# EAGLE design cp2101-esp32 (EAGLE 9.6.2)
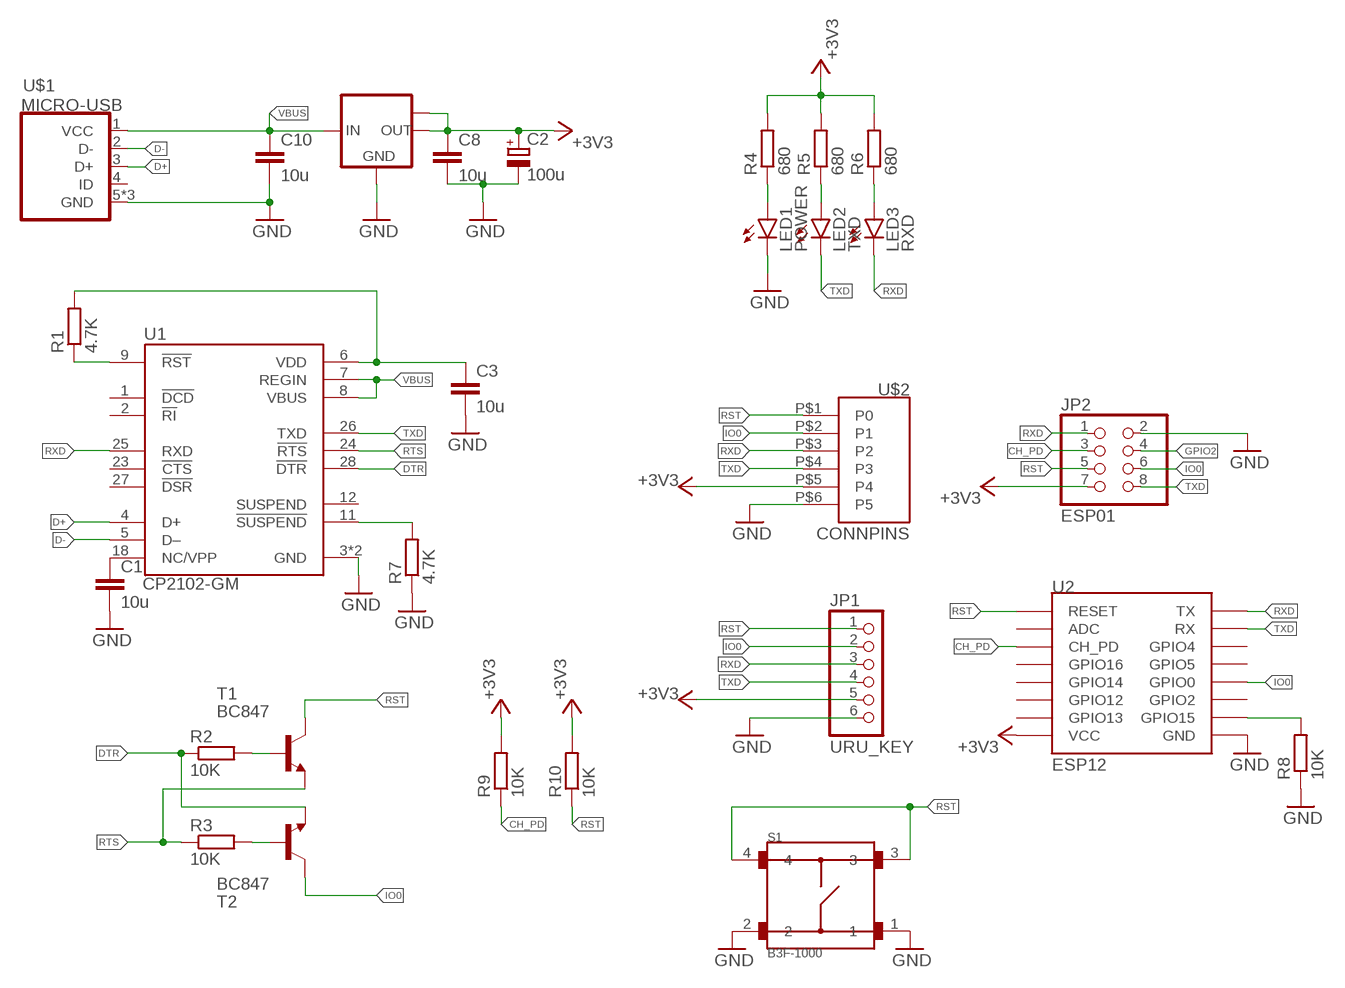
[diagram p0: schematic, sheet 1]

## Parts
C1  10u  C-EUC0805  [C0805]
C2  100u  CPOL-EUA/3216-18R  [A/3216-18R]
C3  10u  C-EUC0805  [C0805]
C8  10u  C-EUC0805  [C0805]
C10  10u  C-EUC0805  [C0805]
IC1  LM1117MPX-3.3  [SOT223]
JP1  URU_KEY  PINHD-1X6/90  [1X06/90]
JP2  ESP01  PINHD-2X4  [2X04]
LED1  POWER  LEDCHIP-LED0805  [CHIP-LED0805]
LED2  TXD  LEDCHIP-LED0805  [CHIP-LED0805]
LED3  RXD  LEDCHIP-LED0805  [CHIP-LED0805]
R1  4.7K  R-EU_R0805  [R0805]
R2  10K  R-EU_R0805  [R0805]
R3  10K  R-EU_R0805  [R0805]
R4  680  R-EU_R0805  [R0805]
R5  680  R-EU_R0805  [R0805]
R6  680  R-EU_R0805  [R0805]
R7  4.7K  R-EU_R0805  [R0805]
R8  10K  R-EU_R0805  [R0805]
R9  10K  R-EU_R0805  [R0805]
R10  10K  R-EU_R0805  [R0805]
S1  B3F-1000  [SW_B3F-1000]
T1  BC847  [SOT23]
T2  BC847  [SOT23]
U1  CP2102-GM  [QFN50P500X500X100-29N]
U2  ESP12  [ESP12]
U$1  MICRO-USB  [MICRO-USB]
U$2  CONNPINS  [PINS]

## Nets
+3V3 [VCC]: C2.+ C8.1 IC1.2(OUT) IC1.TAB(OUT1) JP1.5 JP2.7 R4.2 R5.2 R6.2 R9.2 R10.2 U2.VCC U$2.P$5(P4)
CH_PD: JP2.3 R9.1 U2.CH_PD
D+: U1.4(D+) U$1.3(D+)
D-: U1.5(D–) U$1.2(D-)
DTR: R2.1 T2.2(E) U1.28(!DTR)
GND [GND]: C1.2 C2.- C3.2 C8.2 C10.2 IC1.1(GND) JP1.6 JP2.2 LED1.C R7.1 R8.1 S1.1 S1.2 U1.3(GND) U1.29(GND) U2.GND U$1.5(GND) U$1.GND1(GND) U$1.GND2(GND) U$2.P$6(P5)
GPIO2: JP2.4
IO0: JP1.2 JP2.6 T2.3(C) U2.GPIO0 U$2.P$2(P1)
N$1: C1.1 U1.18(NC/VPP)
N$2: C3.1 R1.2 U1.6(VDD)
N$3: R7.2 U1.11(!SUSPEND)
N$4: R8.2 U2.GPIO15
N$6: LED1.A R4.1
N$7: R1.1 U1.9(!RST)
N$8: R2.2 T1.1(B)
N$9: R3.2 T2.1(B)
N$10: LED2.A R5.1
N$11: LED3.A R6.1
RST: JP1.1 JP2.5 R10.1 S1.3 S1.4 T1.3(C) U2.RESET U$2.P$1(P0)
RTS: R3.1 T1.2(E) U1.24(!RTS)
RXD: JP1.3 JP2.1 LED3.C U1.25(RXD) U2.TX U$2.P$3(P2)
TXD: JP1.4 JP2.8 LED2.C U1.26(TXD) U2.RX U$2.P$4(P3)
VBUS [VCC]: C10.1 IC1.3(IN) U1.7(REGIN) U1.8(VBUS) U$1.1(VCC)
Unconnected: U1.1(!DCD) U1.2(!RI) U1.12(SUSPEND) U1.23(!CTS) U1.27(!DSR) U2.ADC U2.GPIO2 U2.GPIO4 U2.GPIO5 U2.GPIO12 U2.GPIO13 U2.GPIO14 U2.GPIO16 U$1.4(ID)

## Library data of the parts
C1 C3 C8 C10 = rcl:C-EU: CAPACITOR, European symbol; SPICEPREFIX: C
C2 = rcl:CPOL-EU: POLARIZED CAPACITOR, European symbol; SPICEPREFIX: C
IC1 = lm1117:LM1117MPX-*
JP1 = pinhead:PINHD-1X6: PIN HEADER
JP2 = pinhead:PINHD-2X4: PIN HEADER
LED1-LED3 = led:LED: LED OSRAM: - CHIPLED LG R971, LG N971, LY N971, LG Q971, LY Q971, LO R971, LY R971 LH N974, LH R974 LS Q976, LO Q976, LY Q976 LO Q996 - Hyper CHIPLED LW Q18S LB Q993, LB Q99A, LB R99A - SideLED LS A670, LO A670, LY A670, LG A670, LP A670 LB A673, LV A673, LT A673, LW A673 LH A674 LY A675 LS A676, LA A676, LO A676, LY A676, LW A676 LS A679, LY A679, LG A679 - Hyper Micro SIDELED® LS Y876, LA Y876, LO Y876, LY Y876 LT Y87S - SmartLED LW L88C, LW L88S LB L89C, LB L89S, LG L890 LS L89K, LO L89K, LY L89K LS L896, LA L896, LO L896, LY L896 - TOPLED LS T670, LO T670, LY T670, LG T670, LP T670 LSG T670, LSP T670, LSY T670, LOP T670, LYG T670 LG T671, LOG T671, LSG T671 LB T673, LV T673, LT T673, LW T673 LH T674 LS T676, LA T676, LO T676, LY T676, LB T676, LH T676, LSB T676, LW T676 LB T67C, LV T67C, LT T67C, LS T67K, LO T67K, LY T67K, LW E67C LS E67B, LA E67B, LO E67B, LY E67B, LB E67C, LV E67C, LT E67C LW T67C LS T679, LY T679, LG T679 LS T770, LO T770, LY T770, LG T770, LP T770 LB T773, LV T773, LT T773, LW T773 LH T774 LS E675, LA E675, LY E675, LS T675 LS T776, LA T776, LO T776, LY T776, LB T776 LHGB T686 LT T68C, LB T68C - Hyper Mini TOPLED® LB M676 - Mini TOPLED Santana® LG M470 LS M47K, LO M47K, LY M47K Source: http://www.osram.convergy.de LUXEON: - LUMILED® LXK2-PW12-R00, LXK2-PW12-S00, LXK2-PW14-U00, LXK2-PW14-V00 LXK2-PM12-R00, LXK2-PM12-S00, LXK2-PM14-U00 LXK2-PE12-Q00, LXK2-PE12-R00, LXK2-PE12-S00, LXK2-PE14-T00, LXK2-PE14-U00 LXK2-PB12-K00, LXK2-PB12-L00, LXK2-PB12-M00, LXK2-PB14-N00, LXK2-PB14-P00, LXK2-PB14-Q00 LXK2-PR12-L00, LXK2-PR12-M00, LXK2-PR14-Q00, LXK2-PR14-R00 LXK2-PD12-Q00, LXK2-PD12-R00, LXK2-PD12-S00 LXK2-PH12-R00, LXK2-PH12-S00 LXK2-PL12-P00, LXK2-PL12-Q00, LXK2-PL12-R00 Source: www.luxeon.com KINGBRIGHT: KA-3528ASYC Source: www.kingbright.com
R1-R10 = rcl:R-EU_: RESISTOR, European symbol; SPICEPREFIX: R
S1 = B3F-1000:B3F-1000: Switch, FLUX TIGHT MECHANICAL KEYSwitch, , 50MA@24VDC, NO GROUND TERM., FLAT PLUNG Check prices <https://snapeda.com/parts/B3F-1000/Omron/view-part/?ref=eda>; AVAILABILITY: Warning; DESCRIPTION: Tactile Switch SPST-NO Top Actuated Through Hole; DIGIKEY-PURCHASE-URL: https://snapeda.com/shop?store=DigiKey&id=48569; MF: Omron; MOUSER-PURCHASE-URL: https://snapeda.com/shop?store=Mouser&id=48569; MP: B3F-1000; PACKAGE: None; PRICE: None
T1 T2 = transistor:BC847: NPN TRANSISTOR
U1 = CP2102-GM:CP2102-GM: IC USB-TO-UART BRIDGE 28VQFN Check prices <https://snapeda.com/parts/CP2102-GM/Silicon%20Labs/view-part/?ref=eda>; AVAILABILITY: Good; DESCRIPTION: USB Bridge, USB to UART USB 2.0 UART Interface 28-QFN (5x5); DIGIKEY-PURCHASE-URL: https://snapeda.com/shop?store=DigiKey&id=135876; MF: Silicon Labs; MOUSER-PURCHASE-URL: https://snapeda.com/shop?store=Mouser&id=135876; MP: CP2102-GM; PACKAGE: QFN-28 Silicon Labs; PRICE: None
U2 = esp8266modules:ESP12: ESP8266 Wifi module 12
U$1 = microusb:MICRO-USB: Micro USB B connector
U$2 = CONN:CONN

## Net classes
0 default: width 0.25 mm
1 VCC: width 0.4 mm
2 GND: width 0.4 mm

## Board
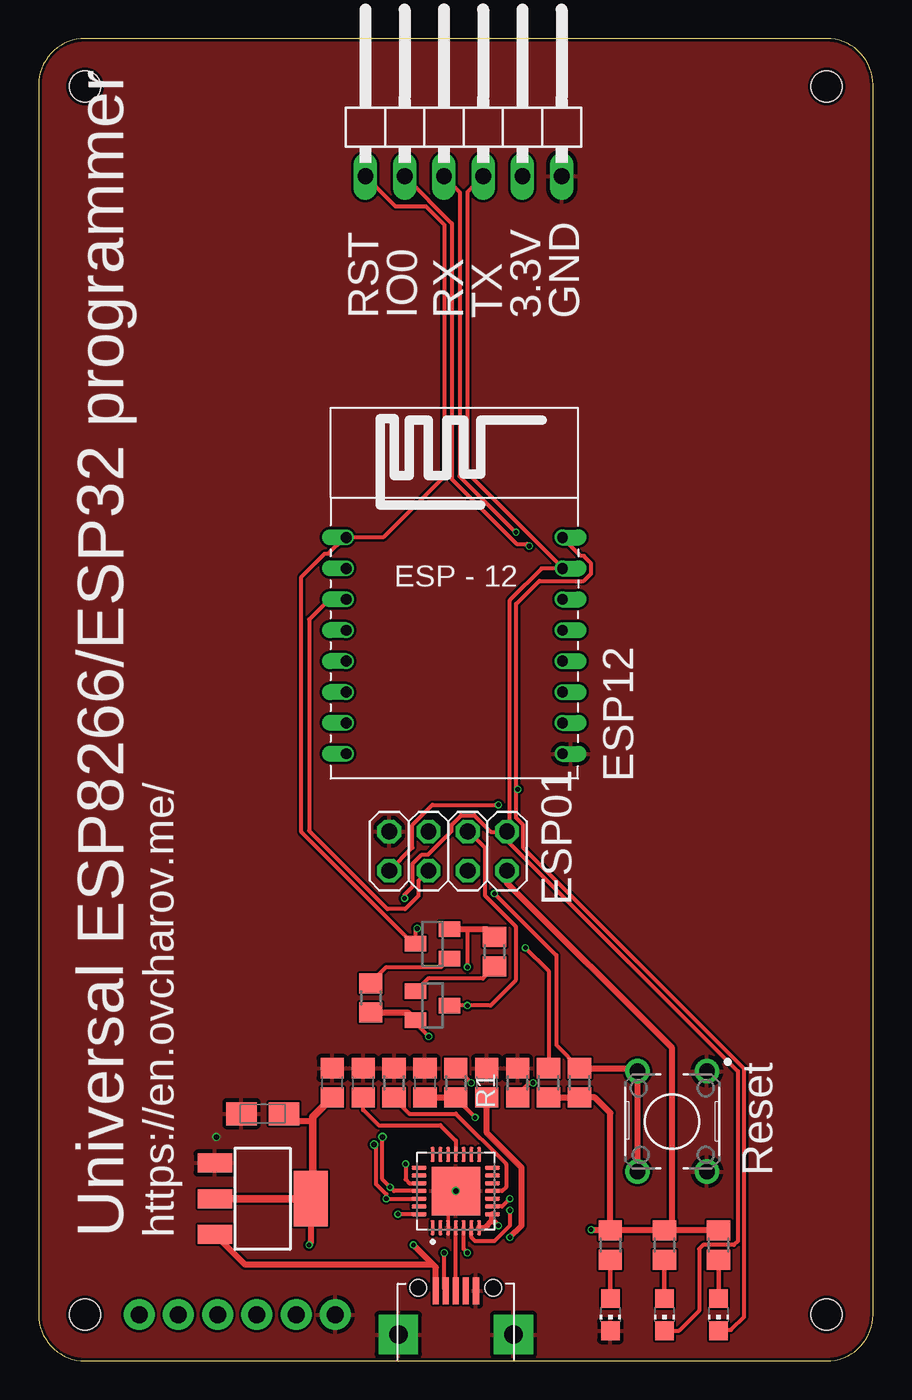
[diagram p1: board, top side]
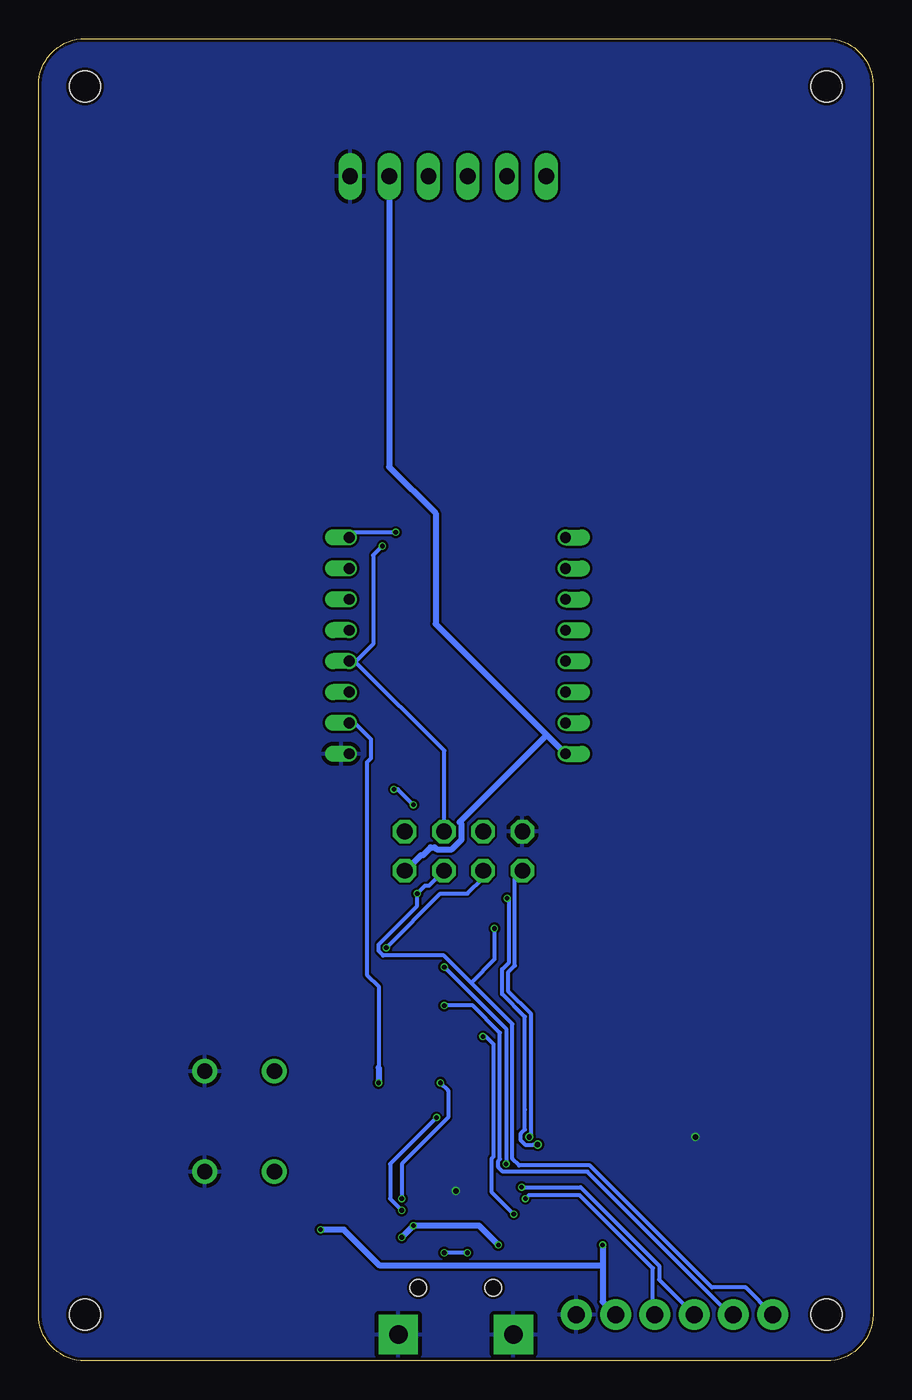
[diagram p2: board, bottom side, seen from below]

Size 54 x 85.6 mm. Coordinates in mm from the lower left corner, seen from the top.
Outline: 3,0 51,0 arc90 54,3 54,82.6 arc90 51,85.6 3,85.6 arc90 0,82.6 0,3 arc90 3,0
Copper layers (1*16): Top 0.035mm / dielectric 1.5mm / Bottom 0.035mm
Design rules "pcbway-5mil": minimum track width 6mil, minimum drill 0.3mm, track to track 6mil, track to pad 6mil, pad to pad 6mil, via to via 6mil, smd to smd 6mil, copper to edge 0.2mm, drill to drill 6mil, minimum pad ring 3mil, minimum via ring 3mil, stop-mask expansion 4mil, vias tented up to drill 0.5mm, thermal gap 10mil
Holes 2 mm at 3,3 51,3 51,82.5 3,82.5

### Footprints (pad centres in the part's own frame; a part is rotated, then mirrored left to right if it is on the bottom)
C0805 = smd 1.3 x 1.5: 1 -0.95,0; 2 0.95,0
A/3216-18R = smd 1.95 x 1.5: + 1.375,0; - -1.375,0
SOT223 = smd 1.219 x 2.235: 1 -2.311,-3.099; 2 0,-3.099; 3 2.311,-3.099 | smd 3.6 x 2.2: TAB 0,3.099
1X06/90 = drill 1.016 long: 1 -6.35,-3.81; 2 -3.81,-3.81; 3 -1.27,-3.81; 4 1.27,-3.81; 5 3.81,-3.81; 6 6.35,-3.81
2X04 = drill 1.016 octagon: 1 -3.81,-1.27; 2 -3.81,1.27; 3 -1.27,-1.27; 4 -1.27,1.27; 5 1.27,-1.27; 6 1.27,1.27; 7 3.81,-1.27; 8 3.81,1.27
CHIP-LED0805 = smd 1.2 x 1.2: A 0,-1.05; C 0,1.05
R0805 = smd 1.3 x 1.5: 1 -0.95,0; 2 0.95,0
SW_B3F-1000 = drill 1 pad 1.6: 1 -3.25,2.25; 2 3.25,2.25; 3 -3.25,-2.25; 4 3.25,-2.25
SOT23 = smd 1 x 1.4: 1 -0.95,-1.1; 2 0.95,-1.1; 3 0,1.1
QFN50P500X500X100-29N = smd 0.97 x 0.26: 1 -2.37,1.5; 2 -2.37,1; 3 -2.37,0.5; 4 -2.37,0; 5 -2.37,-0.5; 6 -2.37,-1; 7 -2.37,-1.5; 15 2.37,-1.5; 16 2.37,-1; 17 2.37,-0.5; 18 2.37,0; 19 2.37,0.5; 20 2.37,1; 21 2.37,1.5 | smd 0.26 x 0.97: 8 -1.5,-2.37; 9 -1,-2.37; 10 -0.5,-2.37; 11 0,-2.37; 12 0.5,-2.37; 13 1,-2.37; 14 1.5,-2.37; 22 1.5,2.37; 23 1,2.37; 24 0.5,2.37; 25 0,2.37; 26 -0.5,2.37; 27 -1,2.37; 28 -1.5,2.37 | smd 3.15 x 3.15: 29 0,0
ESP12 = drill 0.7 offset: ADC -7.1,3.8; CH_PD -7.1,1.8; GND 6.9,-8.2; GPIO0 6.9,-2.2; GPIO2 6.9,-4.2; GPIO4 6.9,1.8; GPIO5 6.9,-0.2; GPIO12 -7.1,-4.2; GPIO13 -7.1,-6.2; GPIO14 -7.1,-2.2; GPIO15 6.9,-6.2; GPIO16 -7.1,-0.2; RESET -7.1,5.8; RX 6.9,3.8; TX 6.9,5.8; VCC -7.1,-8.2
MICRO-USB = smd 0.4 x 1.75: 1 -1.3,4.525; 2 -0.65,4.525; 3 0,4.525; 4 0.65,4.525; 5 1.3,4.525 | drill 1.2 pad 2.54 square: GND1 -3.725,1.7; GND2 3.725,1.7 | hole 1.05: -2.425,4.73; 2.425,4.73
PINS = drill 1.1 pad 2: P$1 0,0; P$2 2.54,0; P$3 5.08,0; P$4 7.62,0; P$5 10.16,0; P$6 12.7,0

### Placement (x,y rotation side)
C1  21,18 90 top
C2  14.5,16 0 top
C3  25,18 90 top
C8  19,18 90 top
C10  29,18 90 top
IC1  14.5,10.5 270 top
JP1  27.5,80.5 0 top
JP2  26.5,33 0 top
LED1  37,3 180 top
LED2  40.5,3 180 top
LED3  44,3 180 top
R1  27,18 270 top
R2  21.5,23.5 90 top
R3  29.5,26.5 270 top
R4  37,7.5 90 top
R5  40.5,7.5 90 top
R6  44,7.5 90 top
R7  23,18 270 top
R8  31,18 270 top
R9  33,18 270 top
R10  35,18 270 top
S1  41,15.5 270 top
T1  25.5,27 90 top
T2  25.5,23 270 top
U1  27,11 90 top
U2  27,47.5 0 top
U$1  27,0 0 top
U$2  6.5,3 0 top

### Tracks (layer width: path | path; a pad name or v marks a point on that pad's centre or on a via)
+3V3  (via drill 0.3)
  Top 0.4: R6.2 R5.2 | R5.2 R4.2 | R9.2 R10.2 36,17.05 37,16.05 R4.2 | IC1.TAB 17.6,7.6 v17.5,7.5 | v35.75,8.5 36.95,8.5 R4.2 | R5.2 41,8.95 41,20.25 30.31,30.94 JP2.7 | 17.75,15.5 16.38,15.5 C2.+
  Top 0.5: C8.1 17.75,15.8 17.75,15.5 17.75,10.65 IC1.TAB IC1.2
  Bottom 0.4: U$2.P$5 17.5,3.84 v17.5,7.5 17.5,6.17 31.92,6.17 34.25,8.5 v35.75,8.5 | JP1.5 31.31,57.88 28.31,54.88 28.31,47.71 21.11,40.51 | 21.11,40.51 U2.VCC | 21.11,40.51 26.75,34.88 26.62,34.75 26.62,33.75 27.25,33.12 28.25,33.12 28.38,33.25 28.62,33.25 29.12,32.75 29.25,32.75 30.25,31.75 JP2.7
CH_PD  (via drill 0.3)
  Top 0.25: R9.1 33,25.25 v31.5,26.75 | 22.57,29.25 17.5,34.32 17.5,48 18.8,49.3 U2.CH_PD
  Top 0.254: 22.57,29.25 23.71,29.25 24.59,30.14 24.59,31.09 JP2.3
  Bottom 0.254: v31.5,26.75 28,30.25 26.25,30.25 25.23,31.27 JP2.3
D+
  Top 0.254: U$1.3 U1.4
D-  (via drill 0.3)
  Top 0.25: 27.5,7.5 U1.5
  Top 0.254: U$1.2 26.25,4.62 v26.25,7 | v27.75,7 27.5,7.25 27.5,7.5
  Bottom 0.254: v26.25,7 v27.75,7
DTR  (via drill 0.3)
  Top 0.254: U1.28 v23.25,9.5 | v25.25,21 24.4,21.85 T2.2
  Top 0.4: R2.1 23.9,22.55 T2.2
  Bottom 0.254: v23.25,9.5 24.66,10.91 24.66,13.13 24.56,13.23 24.56,20.5 25.06,21 v25.25,21
GND  (via drill 0.35)
  Top 0.2: 26.5,9.75 U1.3
  Top 0.4: U1.29 27,10.25 26.5,9.75
  other vias: 27,11 11.5,14.5
  pour Top: 0,0 54,0 54,86 0,86 0,27 0,13
  pour Bottom: 0,0 54,0 54,86 0,86
IO0  (via drill 0.3)
  Top 0.25: v27.75,23 29.25,23 30.88,24.62 30.88,28.12 28.88,30.12 28.88,33.25 27.88,34.25 JP2.6
  Top 0.254: v27.75,23 T2.3 | JP1.2 26.75,73.63 26.75,57.07 30.93,52.89 31.61,52.89 v31.75,52.75
  Bottom 0.25: 33.5,45.25 27.75,39.5 27.75,34.5 JP2.6
  Bottom 0.254: v27.75,23 25.9,23 24.15,21.25 24.15,13.06 24.26,12.96 24.26,12.54 23.96,12.24 18.49,12.24 9.25,3 U$2.P$2 | v31.75,52.75 32.35,52.15 32.35,46.4 33.5,45.25 33.55,45.3 U2.GPIO0
N$1
  Top 0.25: U1.18 27,14.25 26,15.25 22,15.25 21,16.25 C1.1
N$2  (via drill 0.3)
  Top 0.25: U1.6 28,8 28.25,7.75 29.5,7.75 30.5,8.75 v30.5,9.75 | v28.25,15.75 27,17 R1.2
  Top 0.4: C3.1 R1.2
  Bottom 0.25: v30.5,9.75 31.25,10.5 31.25,12.75 v28.25,15.75
N$3
  Top 0.25: U1.11 30,11 30.25,11.25 30.25,12.75 27,16 24,16 23,17 R7.2
N$4  (via drill 0.3)
  Top 0.25: v32,18 31.75,18 31,17.25 R8.2
  Bottom 0.25: 32,19 32,24.25 32.75,25 32.75,38.75 32.5,39 32.5,40.25 33.75,41.5 U2.GPIO15
  Bottom 0.4: 32,19 v32,18
N$6
  Top 0.3: R4.1 LED1.A
N$7  (via drill 0.3)
  Top 0.25: U1.9 30,10 v30.5,10.5 | v28,18 27,19 R1.1
  Bottom 0.25: v30.5,10.5 30.5,12.75 27.5,15.75 27.5,17.5 v28,18
N$8
  Top 0.25: T1.1 26.05,25.5 22.5,25.5 21.5,24.5 R2.2
N$9
  Top 0.25: T2.1 25.2,24.75 28.75,24.75 29.5,25.5 R3.2
N$10
  Top 0.3: R5.1 LED2.A
N$11
  Top 0.3: R6.1 LED3.A
RST  (via drill 0.3)
  Top 0.25: R10.1 33.5,20.45 33.5,26.25 v29.5,30.25 | U2.RESET 19.75,53.25 18.75,52.25 18.5,52.25 17,50.75 17,34.25 24.25,27 T1.3
  Top 0.254: T1.3 24.4,27.9 v24.5,28 | JP1.1 23.09,74.75 25.05,74.75 26.25,73.56 26.25,57.25 22.3,53.3 U2.RESET
  Top 0.4: R10.1 38.55,18.95 S1.3 S1.4
  Bottom 0.25: v29.5,30.25 29,30.75 28.75,30.75 28.25,31.25 28,31.25 27.75,31.5 JP2.5
  Bottom 0.254: U$2.P$1 8.25,4.75 10.43,4.75 18.33,12.65 22.9,12.65 23.35,13.1 23.35,21.81 26.02,24.48 | v29.5,30.25 29.5,29.46 32.01,26.96 32.01,26.54 31.71,26.24 27.78,26.24 26.02,24.48 | v24.5,28 24.5,26 26.02,24.48
RTS  (via drill 0.3)
  Top 0.25: U1.24 24,11.5 23.75,11.75 v23.75,12.75 | 27.75,27.95 v27.75,25.5
  Top 0.4: T1.2 27.75,27.95 29,27.95 R3.1
  Bottom 0.25: v23.75,12.75 23.75,21.5 v27.75,25.5
RXD  (via drill 0.3, 0.35)
  Top 0.25: LED3.C 44,2 | v22.75,11.25 22.25,11.75 v22.25,14.5
  Top 0.254: JP1.3 27.25,75.67 27.25,57.25 30.86,53.64 v30.89,53.64 | U1.25 23,11 v22.75,11.25 | 44,2 44.8,2 45.65,2.86 45.65,18.92 31.35,33.22 31.35,34.7 30.9,35.15 30.9,37 | 30.9,37 30.9,49 32.4,50.5 35.28,50.5 35.75,50.97 35.75,51.63 35.28,52.1 35.1,52.1 U2.TX | JP2.1 24.19,33.23 24.19,34.7 25.49,36 v29.75,36 | v31,37 30.9,37
  Bottom 0.25: v22.25,14.5 22.13,14.62 22.13,16.45
  Bottom 0.254: v30.89,53.64 33.56,53.64 U2.TX | U$2.P$3 13.85,5.27 13.85,6.17 18.93,11.25 v22.75,11.25 | v29.75,36 30.75,37 v31,37 | 22.13,16.45 22.13,22.45 23.59,23.92 23.59,25.18 23.18,25.59 23.18,31.24 JP2.1
TXD  (via drill 0.3, 0.35)
  Top 0.25: LED2.C 41.45,1.95 42.75,3.25 42.75,7.25 43,7.5 45,7.5 45.25,7.75 45.25,18.75 30.5,33.5 | U1.26 v22.5,10.5 22.5,10.79 21.85,11.44 21.85,13.86 v21.71,14 | 30.5,34.5 30.5,49.25 32.55,51.3 U2.RX 33.75,51.5
  Top 0.254: JP1.4 27.75,75.67 27.75,57.5 33.75,51.5 | v23.69,29.94 23.69,30.19 24.19,30.69 24.19,32.16 24.8,32.77 25.2,32.77 26.73,34.3 26.73,34.7 27.34,35.31 28.2,35.31 29.26,34.25 30.29,34.25 JP2.8 | JP2.8 30.31,34.31 30.5,34.5 | 30.5,33.5 30.31,33.69 JP2.8
  Bottom 0.25: v22.5,10.5 22.25,10.75 19,10.75 14.25,6 14.25,3 U$2.P$4 | 22.53,16.28 22.53,14.98 22.79,14.72 22.79,14.28 22.47,13.96 22.03,13.96 21.99,14 v21.71,14
  Bottom 0.254: 22.53,16.28 22.53,22.28 24,23.75 24,25.35 23.59,25.76 23.59,29.84 v23.69,29.94
VBUS  (via drill 0.3)
  Top 0.4: IC1.3 13.34,6.25 25.5,6.25 | U1.7 28.88,8.63 29.37,9.12 | 29.37,9.12 U1.8 | C10.1 29,14.75 31.25,12.5 31.25,8.75 v30.5,8 | v29.75,8.75 29.5,9 29.37,9.12 | U$1.1 25.7,6.05 25.5,6.25 | 25.5,6.25 v24.25,7.5
  Bottom 0.4: v30.5,8 v29.75,8.75 25.5,8.75 v24.25,7.5

### Text on the board
tNames: RST | IO0 | RX | TX | 3.3V | GND | ESP12 | ESP01 | Reset | Universal ESP8266/ESP32 programmer | https://en.ovcharov.me/